# EasyEDA Pro project ProPrj_赛博沙漏彩砂版二代（完全开源）_2025-03-31.epro, schematic Schematic1_1
Create Date: 2023-11-27; Page Name: P1; Project Name: ShaLou7Color; Schematic Name: Schematic1_1; Update Date: 2023-11-27; Company: 嘉立创EDA; Page Size: A4; Version: V1.0
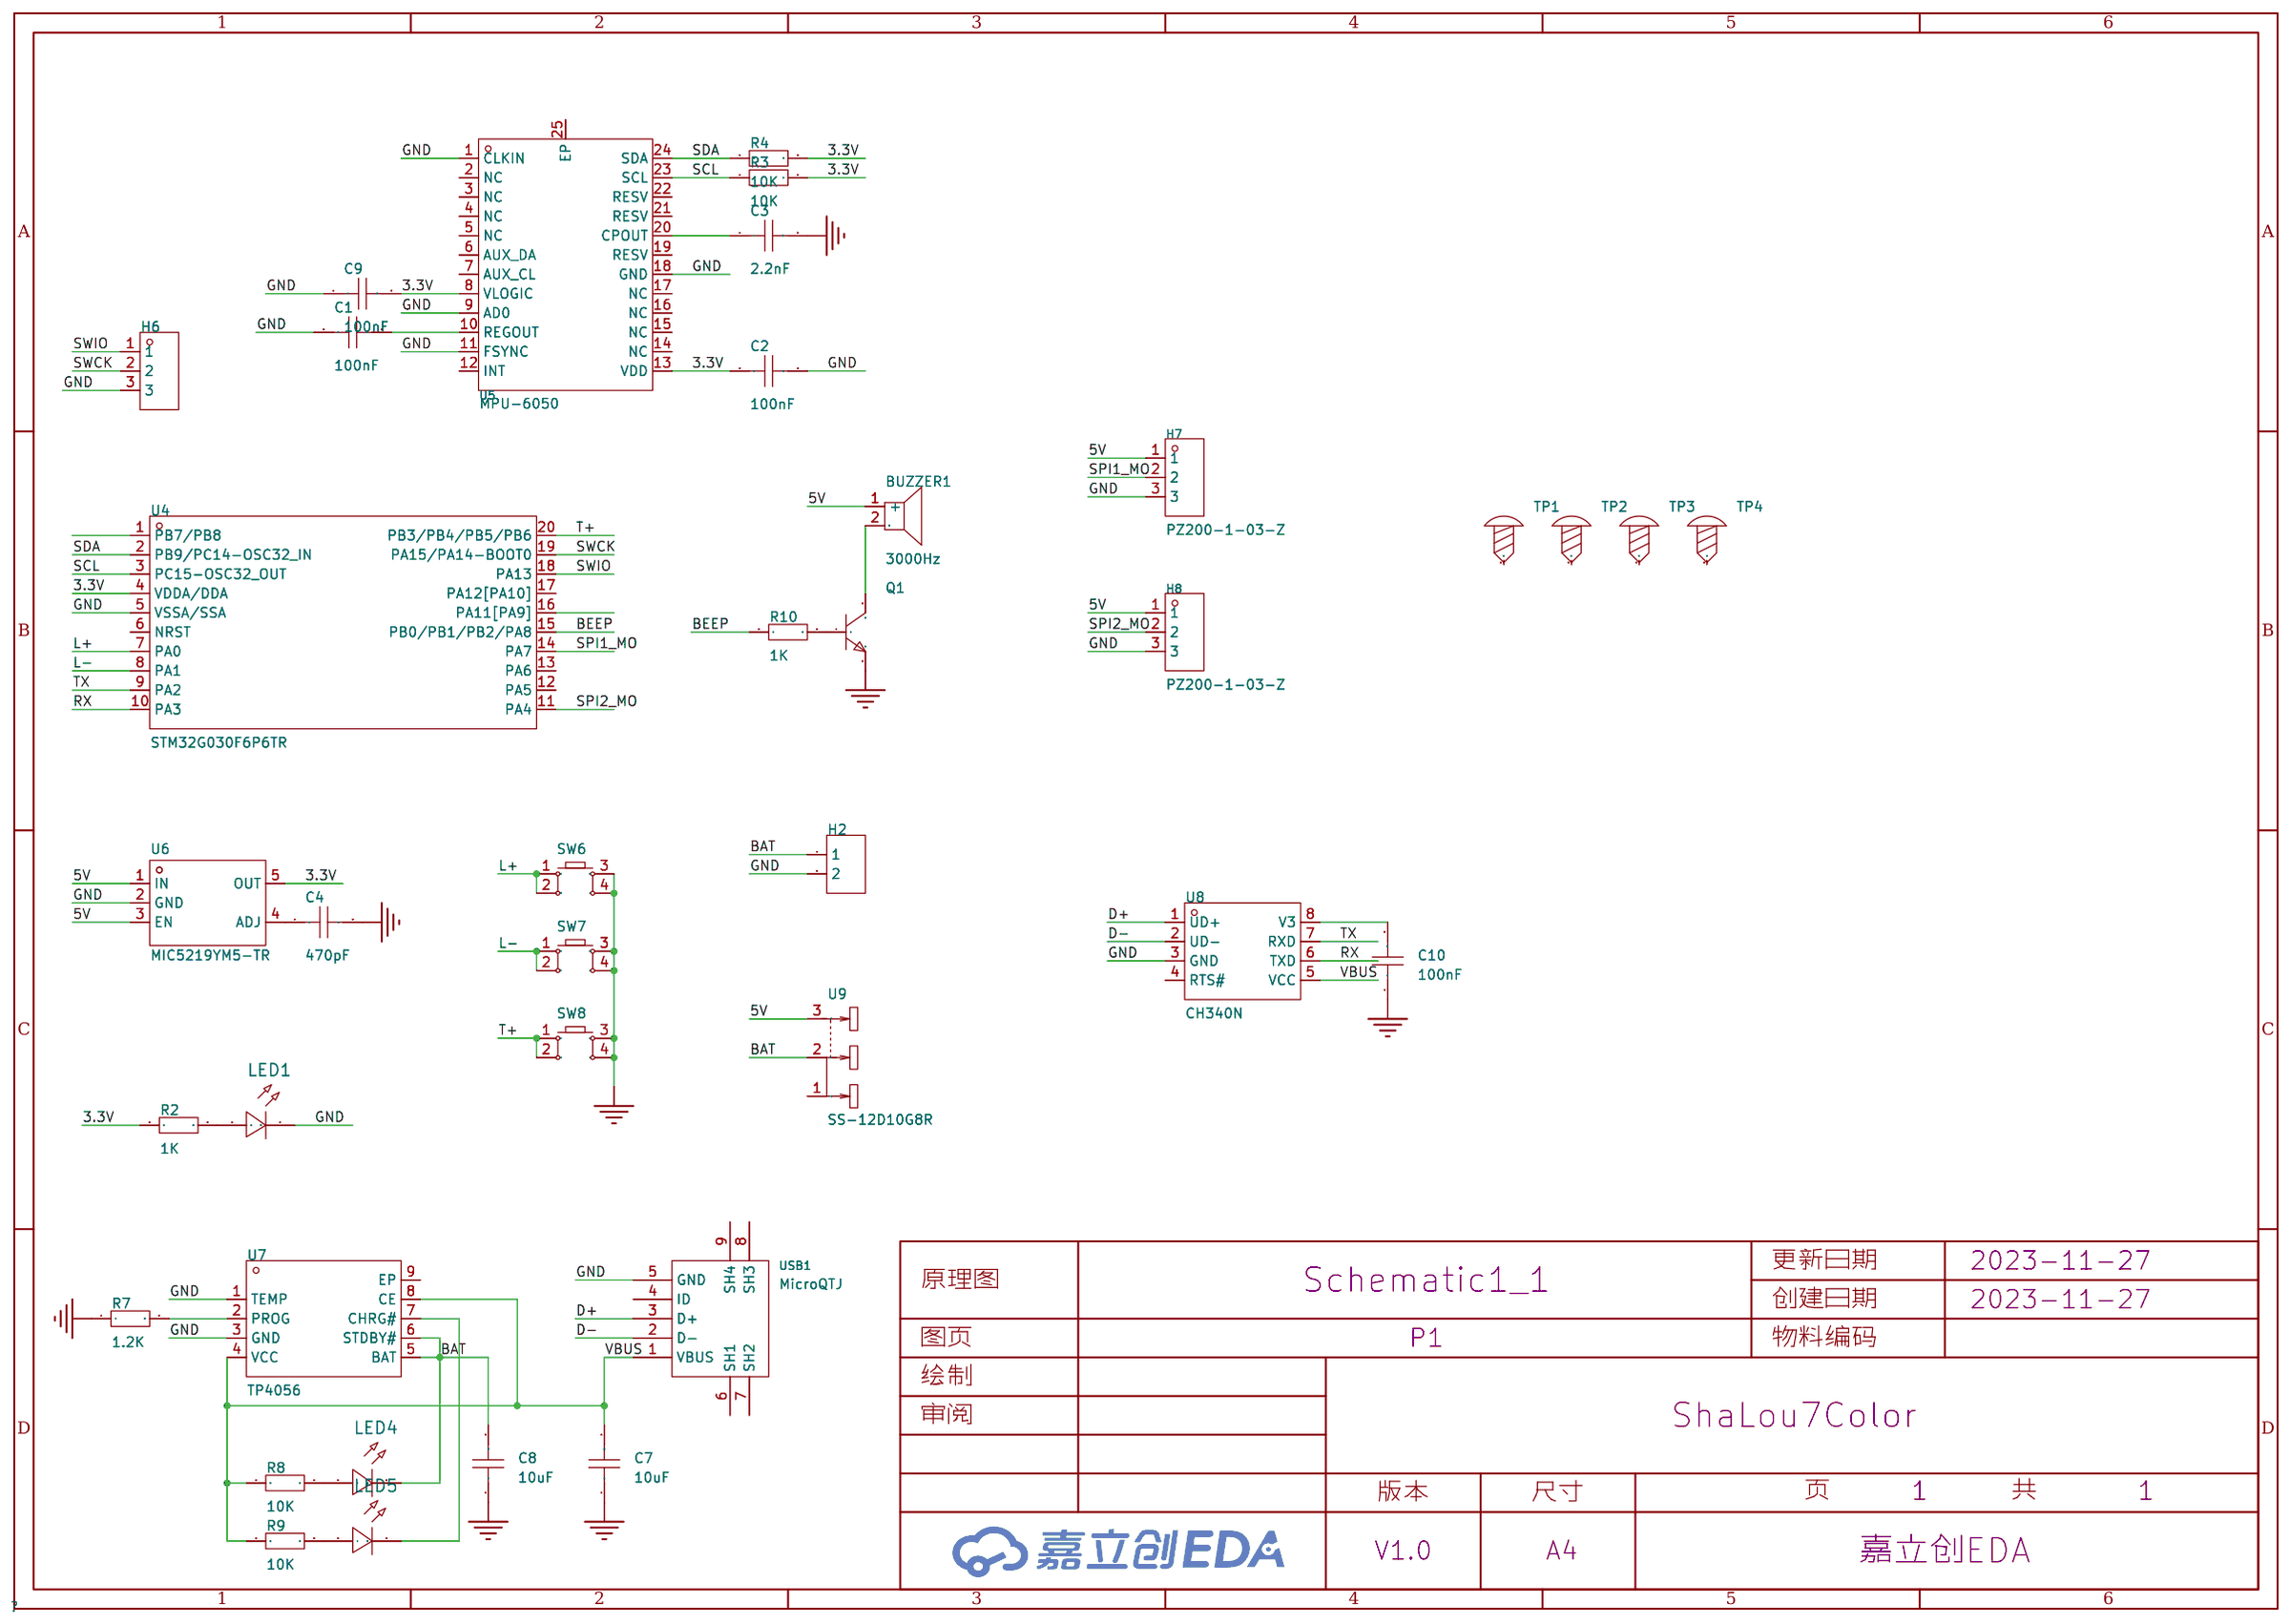
[diagram p0: schematic sheet]

## Parts
BUZZER1  3000Hz  [BUZ-TH_BD9.6-P5.00-D0.7-FD]
C1  100nF  [C0603]
C2  100nF  [C0603]
C3  2.2nF  [C0603]
C4  470pF  [C0603]
C7  10uF  [C0603]
C8  10uF  [C0603]
C9  100nF  [C0603]
C10  100nF  [C0603]
H2  -  [HDR-TH_2P-P2.54-V-F]
H6  -  [HDR-TH_3P-P2.54-V-F]
H7  PZ200-1-03-Z  [HDR-TH_3P-P2.00-V-M]
H8  PZ200-1-03-Z  [HDR-TH_3P-P2.00-V-M]
LED1  -  [LED_0603]
LED4  -  [LED_0603]
LED5  -  [LED_0603]
Q1  -  [S8050_SOT-23]
R2  1K  [R0603]
R3  10K  [R0603]
R4  10K  [R0603]
R7  1.2K  [R0603]
R8  10K  [R0603]
R9  10K  [R0603]
R10  1K  [R0603]
SW6  -  [SW-SMD_4P-L6.0-W6.0-P4.50-LS9.0-2]
SW7  -  [SW-SMD_4P-L6.0-W6.0-P4.50-LS9.0-2]
SW8  -  [SW-SMD_4P-L6.0-W6.0-P4.50-LS9.0-2]
TP1  -  [M2螺丝]
TP2  -  [M2螺丝]
TP3  -  [M2螺丝]
TP4  -  [M2螺丝]
U4  STM32G030F6P6TR  [TSSOP-20_L6.5-W4.4-P0.65-LS6.4-BL]
U5  MPU-6050  [QFN-24_L4.0-W4.0-P0.50-BL-EP2.7]
U6  MIC5219YM5-TR  [SOT-23-5_L3.0-W1.7-P0.95-LS2.8-TL]
U7  TP4056  [ESOP-8_L4.9-W3.9-P1.27-LS6.0-BL-EP]
U8  CH340N  [SOP-8_L4.9-W3.9-P1.27-LS6.0-BL]
U9  SS-12D10G8R  [SW-TH_XKB_SS-12D10G8R]
USB1  MicroQTJ  [MICRO-USB-SMD_MICROQTJ]

## Library data of the parts
BUZZER1 = HNB09A05: 驱动方式:有源(内含驱动线路);构造类型:电磁式;额定电压:5V;工作电压:4V~8V;频率:3000Hz;声压(SPL):85dB@5V,10cm;直径(φD):9mm;高度:5.7mm;; Supplier Part: C96493; Manufacturer: 华能; Supplier Footprint: 插件; JLCPCB Part Class: 扩展库; Datasheet: https://atta.szlcsc.com/upload/public/pdf/source/20170522/1495448327549.pdf; Supplier: LCSC; Oscillator Circuit: 有源(内含驱动线路); Technology Type: 电磁式; Rated Voltage: 5V; Operating Voltage: 4V~8V; Sound Pressure Level (SPL): 85dB@5V,10cm; Diameter (φD): 9mm; Height: 5.7mm
C1-C4 C7-C10 = CAP_0603: Supplier Footprint: 0603
H2 = HDR-F_2.54_1x2P: Supplier Part: C49661; Supplier Footprint: 插件
H6 = HDR-F_2.54_1x3P: Supplier Part: C541850; Supplier Footprint: 插件
H7 H8 = PZ200-1-03-Z: 排数:单排;总PIN位数:3;间距:2mm;插针结构:1x3P;行距:-;安装类型:直插;圆针/方针:方针;额定电流:1.5A;额定电压:-;配合针长度:4mm;塑高:2mm;端接针长度:2.8mm;工作温度范围:-40℃~+105℃;颜色:黑色;; LCSC Part Name: 2mm 1x3P 直插 方针; Supplier Part: C2905949; Manufacturer: HCTL(华灿天禄); Supplier Footprint: 直插,P=2mm; JLCPCB Part Class: Extended Part; Supplier: LCSC; Number of Rows: 单排; Number of Pins: 3; Pitch: 2mm; Pin Structure: 1x3P; Mounting Type: 直插; Circluar Pins/Square Pins: 方针; Current Rating (Max): 1.5A; Length of Mating Pin: 4mm; Insulation Height: 2mm; Length of End Connection Pin: 2.8mm; Operating Temperature Range: -40℃~+105℃; Color: 黑色
LED1 LED4 LED5 = LED_0603-R: Supplier Footprint: 0603
Q1 = S8050_SOT_NPN: Supplier Footprint: SOT-23
R2-R4 R7-R10 = Res_0603: Supplier Footprint: 0603
SW6-SW8 = Key_SMD_6x6x6.5: Supplier Footprint: SMD
TP1-TP4 = M2螺丝: Supplier Footprint: 插件
U4 = STM32G030F6P6TR: CPU内核:ARM Cortex-M0;CPU最大主频:64MHz;工作电压范围:2V~3.6V;程序存储容量:32KB;RAM总容量:8KB;EEPROM/数据 FLASH容量:32KB;GPIO端口数量:17;ADC(位数):12bit;DAC(位数):-;(E)PWM(位数):-;外设/功能:DMA；PWM；看门狗;内部振荡器:有;工作温度范围:-40℃~+85℃;; LCSC Part Name: ARM Cortex-M0 64MHz; Supplier Part: C529330; Manufacturer: ST(意法半导体); Supplier Footprint: TSSOP-20; JLCPCB Part Class: Extended Part; Datasheet: https://atta.szlcsc.com/upload/public/pdf/source/20200511/C529329_A1CB615556C746C4EA827FCAD1461480.pdf; Supplier: LCSC; CPU Core: ARM Cortex-M0; CPU Maximum Speed: 64MHz; Operating Voltage Range: 2V~3.6V; Program Storage Size: 32KB; Program Memory Type: FLASH; RAM Size: 8KB; EEPROM: 32KB; GPIO Ports Number: 17; ADC (Bit): 12bit; Peripheral/Function: DMA；PWM；看门狗; Internal Oscillator: 有; Operating Temperature Range: -40℃~+85℃
U5 = MPU-6050: 三轴加速度计和三轴陀螺仪，工作电压：2.375V~3.46V; Supplier Part: C24112; Manufacturer: TDK InvenSense(应美盛); Supplier Footprint: QFN-24(4x4); JLCPCB Part Class: 扩展库; Datasheet: https://atta.szlcsc.com/upload/public/pdf/source/20140425/1457707046159.pdf; Supplier: LCSC
U6 = MIC5219YM5-TR: 输出类型:-;; Supplier Part: C145689; Manufacturer: MICROCHIP(美国微芯); Supplier Footprint: SOT-23-5; JLCPCB Part Class: 扩展库; Datasheet: https://atta.szlcsc.com/upload/public/pdf/source/20171212/C145689_15130637213801177745.pdf; Supplier: LCSC
U7 = TP4056_C725790: Supplier Part: C725790; Manufacturer: UMW(友台半导体); Supplier Footprint: ESOP-8; JLCPCB Part Class: 扩展库; Datasheet: https://atta.szlcsc.com/upload/public/pdf/source/20211011/37515E71BA298E23D23475482C49633D.pdf; Supplier: LCSC
U8 = CH340N: LCSC Part Name: USB转串口芯片 CH340; Supplier Part: C2977777; Manufacturer: WCH(南京沁恒); Supplier Footprint: SOP-8; JLCPCB Part Class: 扩展库; Datasheet: https://atta.szlcsc.com/upload/public/pdf/source/20230530/6E401E9554E9F5311886CC8B3F89B62E.pdf; Supplier: LCSC
U9 = SS-12D10G8R: 额定电流(DC):3A;额定电压(DC):125V;额定电流(AC):3A;额定电压(AC):125V;电路结构:单刀双掷;安装方式:直插;机械寿命:1万次;开关颜色:黑色;; LCSC Part Name: 柄长8mm 直插双档 滑动开关; Supplier Part: C2884776; Manufacturer: XKB Connectivity(中国星坤); Supplier Footprint: 插件; JLCPCB Part Class: 扩展库; Datasheet: https://atta.szlcsc.com/upload/public/pdf/source/20211009/D6412F37AABE6F9459A6EE7FA4DAEADB.pdf; Supplier: LCSC; Current Rating (DC): 3A; Voltage Rating (DC): 125V; Current Rating (AC): 3A; Voltage Rating (AC): 125V; Circuit: 单刀双掷; Mounting Style: 直插; Mechanical Life: 1万次; Actuator Color: 黑色; Actuator Style: 矩形柱状; Pin Style: PC引脚; Operating Temperature: -40℃~+85℃; Switch Length: 13mm; Switch Width: 6.4mm; Switch Height: 6mm
USB1 = MicroQTJ: 连接器类型:Micro-B;标准:USB 2.0;公母:母座;触点数量:5;端口数量:1;安装方式:卧贴;额定电流 - 电源:-;工作温度范围:-30℃~+80℃;; LCSC Part Name: Micro USB 母座 5P 全贴有柱; Supplier Part: C404968; Manufacturer: SHOU HAN(首韩); Supplier Footprint: SMD; JLCPCB Part Class: 扩展库; Supplier: LCSC; Connector Type: Micro-B; Standard: USB 2.0; Gender: 母座; Number of Contacts: 5; Number of Ports: 1; Mounting Style: 卧贴; Operating Temperature Range: -30℃~+80℃

## Nets
3.3V: C2.1 C9.2 R2.1 R3.2 R4.2 U4.4(VDDA/DDA) U5.8(VLOGIC) U5.13(VDD) U6.5(OUT)
5V: BUZZER1.1(+) H7.1 H8.1 U6.1(IN) U6.3(EN) U9.3
GND: C1.1 C2.2 C3.2 C4.2 C7.1 C8.1 C9.1 C10.1 H2.2 H6.3 H7.3 H8.3 LED1.1(C) Q1.2 R7.1 SW6.3 SW6.4 SW7.3 SW7.4 SW8.3 SW8.4 U4.5(VSSA/SSA) U5.1(CLKIN) U5.9(AD0) U5.11(FSYNC) U5.18(GND) U6.2(GND) U7.1(TEMP) U7.3(GND) U8.3(GND) USB1.5(GND)
VBUS: C7.2 R8.1 R9.1 U7.4(VCC) U7.8(CE) U8.5(VCC) USB1.1(VBUS)
BAT: C8.2 H2.1 U7.5(BAT) U9.2
BEEP: R10.1 U4.15(PB0/PB1/PB2/PA8)
D+: U8.1(UD+) USB1.3(D+)
D-: U8.2(UD-) USB1.2(D-)
L+: SW6.1 SW6.2 U4.7(PA0)
L-: SW7.1 SW7.2 U4.8(PA1)
RX: U4.10(PA3) U8.6(TXD)
SCL: R3.1 U4.3(PC15-OSC32_OUT) U5.23(SCL)
SDA: R4.1 U4.2(PB9/PC14-OSC32_IN) U5.24(SDA)
SPI1_MO: H7.2 U4.14(PA7)
SPI2_MO: H8.2 U4.11(PA4)
SWCK: H6.2 U4.19(PA15/PA14-BOOT0)
SWIO: H6.1 U4.18(PA13)
T+: SW8.1 SW8.2 U4.20(PB3/PB4/PB5/PB6)
TX: U4.9(PA2) U8.7(RXD)
$1N1404: LED1.2(A) R2.2
$1N1449: C1.2 U5.10(REGOUT)
$1N1455: C3.1 U5.20(CPOUT)
$1N1464: C4.1 U6.4(ADJ)
$1N1498: R7.2 U7.2(PROG)
$1N1499: LED4.2(A) R8.2
$1N1500: LED5.2(A) R9.2
$1N1501: LED4.1(C) U7.6(STDBY#)
$1N1502: LED5.1(C) U7.7(CHRG#)
$1N1507: Q1.1 R10.2
$1N1508: BUZZER1.2 Q1.3
$1N2510: C10.2 U8.8(V3)

Not connected (* = marked no-connect by the designer): TP1 1; TP2 1; TP3 1; TP4 1; U4 1(PB7/PB8) 6(NRST) 12(PA5) 13(PA6) 16(PA11[PA9]) 17(PA12[PA10]); U5 2(NC) 3(NC) 4(NC) 5(NC) 6(AUX_DA) 7(AUX_CL) 12(INT) 14(NC) 15(NC) 16(NC) 17(NC) 19(RESV) 21(RESV) 22(RESV) 25(EP); U7 9(EP); U8 4(RTS#); U9 1; USB1 4(ID) 6(SH1) 7(SH2) 8(SH3) 9(SH4)
